# EAGLE schematic esp01-breadboard (EAGLE 7.4.0)
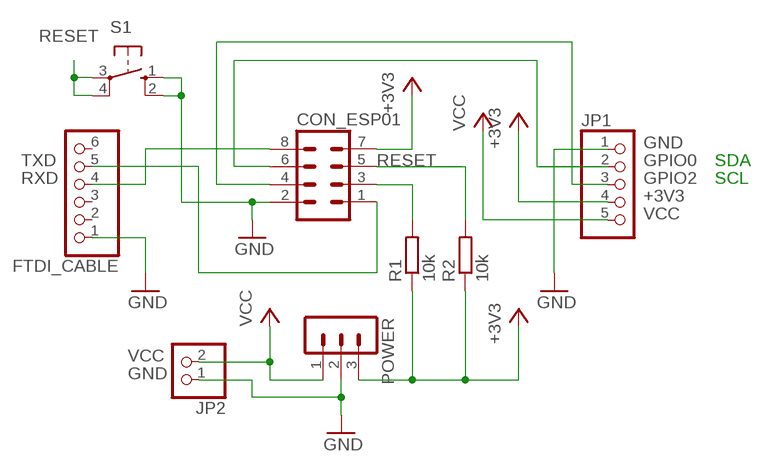
[diagram p0: schematic, sheet 1]

## Parts
CON_ESP01  MA04-2  [MA04-2]
FTDI_CABLE  PINHD-1X6  [1X06]
JP1  PINHD-1X5  [1X05]
JP2  PINHD-1X2  [1X02]
POWER  MA03-1  [MA03-1]
R1  10k  R-EU_0204/5  [0204/5]
R2  10k  R-EU_0204/5  [0204/5]
S1  10-XX  [B3F-10XX]

## Nets
+3V3: CON_ESP01.7 JP1.4 POWER.3 R1.1 R2.1
GND: CON_ESP01.2 FTDI_CABLE.1 JP1.1 JP2.1 POWER.2 S1.1(S) S1.2(S1)
GPIO0: CON_ESP01.6 JP1.2
GPIO2: CON_ESP01.4 JP1.3
N$1: CON_ESP01.3 R1.2
RESET: CON_ESP01.5 R2.2 S1.3(P) S1.4(P1)
RXD: CON_ESP01.8 FTDI_CABLE.4
TXD: CON_ESP01.1 FTDI_CABLE.5
VCC: JP1.5 JP2.2 POWER.1
Unconnected: FTDI_CABLE.2 FTDI_CABLE.3 FTDI_CABLE.6

## Notes on the sheet
- SDA
- SCL

## Library data of the parts
CON_ESP01 = con-lstb:MA04-2: PIN HEADER; OC_FARNELL: unknown; OC_NEWARK: unknown
FTDI_CABLE = pinhead:PINHD-1X6: PIN HEADER
JP1 = pinhead:PINHD-1X5: PIN HEADER
JP2 = pinhead:PINHD-1X2: PIN HEADER
POWER = con-lstb:MA03-1: PIN HEADER; OC_FARNELL: unknown; OC_NEWARK: unknown
R1 R2 = resistor:R-EU_: RESISTOR, European symbol
S1 = switch-omron:10-XX: OMRON SWITCH; MPN: B3F-1000; OC_FARNELL: 176432; OC_NEWARK: 36M3542